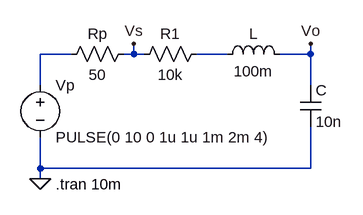
[diagram p0: schematic lab8-1.asc]
lab8-1.asc, the LTspice schematic file:
Version 4
SHEET 1 880 680
WIRE -48 80 -96 80
WIRE 48 80 48 64
WIRE 48 80 32 80
WIRE 64 80 48 80
WIRE 192 80 144 80
WIRE 320 80 320 64
WIRE 320 80 272 80
WIRE -96 128 -96 80
WIRE 320 128 320 80
WIRE -96 256 -96 208
WIRE 320 256 320 192
WIRE 320 256 -96 256
WIRE -96 272 -96 256
FLAG 320 64 Vo
FLAG 48 64 Vs
FLAG -96 272 0
SYMBOL voltage -96 112 R0
WINDOW 123 0 0 Left 2
WINDOW 39 0 0 Left 2
SYMATTR InstName Vp
SYMATTR Value PULSE(0 10 0 1u 1u 1m 2m 4)
SYMBOL res -64 96 R270
WINDOW 0 32 56 VTop 2
WINDOW 3 0 56 VBottom 2
SYMATTR InstName Rp
SYMATTR Value 50
SYMBOL res 48 96 R270
WINDOW 0 32 56 VTop 2
WINDOW 3 0 56 VBottom 2
SYMATTR InstName R1
SYMATTR Value 10k
SYMBOL ind 176 96 R270
WINDOW 0 32 56 VTop 2
WINDOW 3 5 56 VBottom 2
SYMATTR InstName L
SYMATTR Value 100m
SYMBOL cap 304 128 R0
SYMATTR InstName C
SYMATTR Value 10n
TEXT -72 280 Left 2 !.tran 10m

The netlist it stands for:
* lab8-1.asc
Vp N001 0 PULSE(0 10 0 1u 1u 1m 2m 4)
Rp N001 Vs 50
R1 Vs N002 10k
L N002 Vo 100m
C Vo 0 10n
.tran 10m
.backanno
.end

* Results of the author's LTspice run, read from the files saved beside the schematic
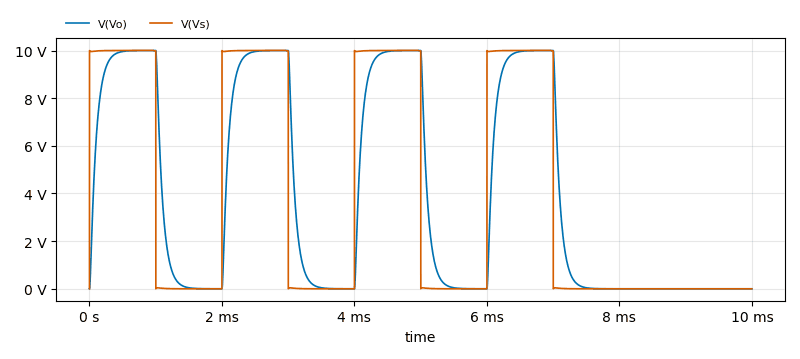
[diagram p1: Transient Analysis of lab8-1.asc, plotted from the saved traces]
* Transient Analysis, 1 run:
*   V(Vo): min 0 V, max 10 V, average 4.004 V, rms 6.035 V, last 0 V
*   V(Vs): min 0 V, max 10.01 V, average 4.004 V, rms 6.323 V, last 0 V